# Altium schematic sheet PLL_Block.SchDoc
size A4; SheetNumber: 2; SheetTotal: 13
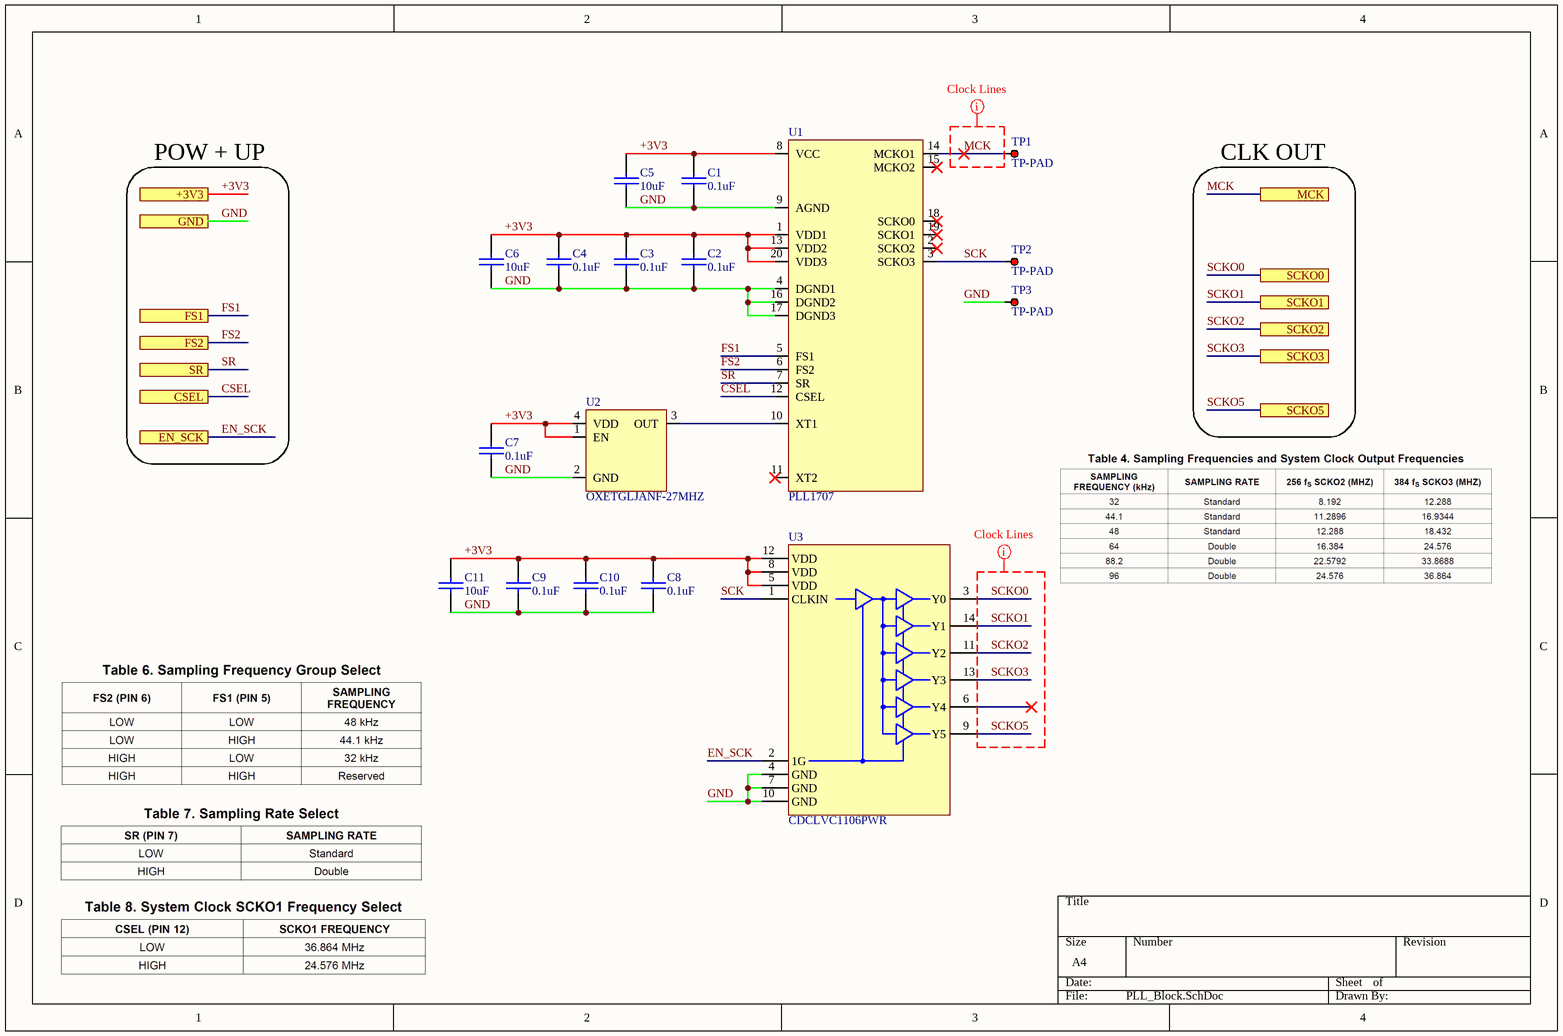
[diagram p0: PLL_Block.SchDoc]

## Parts
C1  0.1uF  [0402-CAP-TDK]
C2  0.1uF  [0402-CAP-TDK]
C3  0.1uF  [0402-CAP-TDK]
C4  0.1uF  [0402-CAP-TDK]
C5  10uF  [0603-CAP-TDK]
C6  10uF  [0603-CAP-TDK]
C7  0.1uF  [0402-CAP-TDK]
C8  0.1uF  [0402-CAP-TDK]
C9  0.1uF  [0402-CAP-TDK]
C10  0.1uF  [0402-CAP-TDK]
C11  10uF  [0603-CAP-TDK]
TP1  TP-PAD  [TPTH - PAD TOP]  (no BOM)
TP2  TP-PAD  [TPTH - PAD TOP]  (no BOM)
TP3  TP-PAD  [TPTH - PAD TOP]  (no BOM)
U1  PLL1707  [TI-SSOP-20 - DBQ (R-PDSO-G20)]
U2  OXETGLJANF-27MHZ  [SMD3225]
U3  CDCLVC1106PWR  [TI-TSSOP-14-PW0014A]

## Ports
+3V3 (see AudioDSP-v3.0.0c_top[2C], ADC_Block[1A], ADC_Interface[1B], CTRL_Connectors[1A], DAC_Block[1B], DSP_Block[1A], MCU_Block[1A], POW_Block[4B]), CSEL (see AudioDSP-v3.0.0c_top[2C], MCU_Block[4C]), EN_SCK (see AudioDSP-v3.0.0c_top[2C], MCU_Block[4B]), FS1 (see AudioDSP-v3.0.0c_top[2C], MCU_Block[4B]), FS2 (see AudioDSP-v3.0.0c_top[2C], MCU_Block[4B]), GND (see AudioDSP-v3.0.0c_top[2C], ADC_Block[1B], ADC_Interface[1B], CTRL_Connectors[1A], DAC_Block[1B], DSP_Block[1A], IN_Connectors[3A], LPF_Block[1B], LPF_Interface[1B], MCU_Block[1B], OUT_Connectors[3B], POW_Block[1B]), MCK (see AudioDSP-v3.0.0c_top[3C]), SCKO0 (see AudioDSP-v3.0.0c_top[3C]), SCKO1 (see AudioDSP-v3.0.0c_top[3C]), SCKO2 (see AudioDSP-v3.0.0c_top[3C]), SCKO3 (see AudioDSP-v3.0.0c_top[3C]), SCKO5 (see AudioDSP-v3.0.0c_top[3C]), SR (see AudioDSP-v3.0.0c_top[2C], MCU_Block[4C])

## Nets
+3V3: C1.2 C2.2 C3.2 C4.2 C5.2 C6.2 C7.2 C8.2 C9.2 C10.2 C11.2 U1.1(VDD1) U1.8(VCC) U1.13(VDD2) U1.20(VDD3) U2.1(EN) U2.4(VDD) U3.5(VDD) U3.8(VDD) U3.12(VDD) ; port +3V3
CSEL: U1.12(CSEL) ; port CSEL
EN_SCK: U3.2(1G) ; port EN_SCK
FS1: U1.5(FS1) ; port FS1
FS2: U1.6(FS2) ; port FS2
GND: C1.1 C2.1 C3.1 C4.1 C5.1 C6.1 C7.1 C8.1 C9.1 C10.1 C11.1 TP3.1 U1.4(DGND1) U1.9(AGND) U1.16(DGND2) U1.17(DGND3) U2.2(GND) U3.4(GND) U3.7(GND) U3.10(GND) ; port GND
MCK: TP1.1 U1.14(MCKO1) ; port MCK
SCK: TP2.1 U1.3(SCKO3) U3.1(CLKIN)
SCKO0: U3.3(Y0) ; port SCKO0
SCKO1: U3.14(Y1) ; port SCKO1
SCKO2: U3.11(Y2) ; port SCKO2
SCKO3: U3.13(Y3) ; port SCKO3
SCKO5: U3.9(Y5) ; port SCKO5
SR: U1.7(SR) ; port SR
NetU1_10: U1.10(XT1) U2.3(OUT)

Not connected (* = marked no-connect by the designer): U1 2(SCKO2)* 11(XT2)* 15(MCKO2)* 18(SCKO0)* 19(SCKO1)*; U3 6(Y4)*

## Layout directives
net class CLK: MCK, SCKO0, SCKO1, SCKO2, SCKO3, SCKO5

## Notes on the sheet
- POW + UP
- CLK OUT

## Library data of the parts
C1-C11 = CAP-SMD
  C1-C4 C7-C10: JLCPart: C307331
  C5 C6 C11: JLCPart: C96446
U1 = PLL1707: Dual PLL Multi-Clock Generator; JLCPart: C1519963
U2 = OXETGLJANF-27MHZ: 3.3V ±50ppm 27MHz SMD3225-4P Oscillators; JLCPart: C295526
U3 = CDCLVC1106PWR: LVCMOS High-Performance Clock Buffer 6-Output; JLCPart: C56506